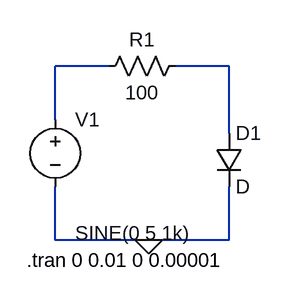
[diagram p0: schematic Rectificador de media vuelta.asc]
Rectificador de media vuelta.asc, the LTspice schematic file:
Version 4
SHEET 1 880 680
WIRE 128 -112 64 -112
WIRE 272 -112 208 -112
WIRE 64 -48 64 -112
WIRE 272 -32 272 -112
WIRE 64 96 64 32
WIRE 176 96 64 96
WIRE 272 96 272 32
WIRE 272 96 176 96
FLAG 176 96 0
SYMBOL diode 256 -32 R0
SYMATTR InstName D1
SYMBOL res 224 -128 R90
WINDOW 0 0 56 VBottom 2
WINDOW 3 32 56 VTop 2
SYMATTR InstName R1
SYMATTR Value 100
SYMBOL voltage 64 -64 R0
WINDOW 3 24 152 Left 2
WINDOW 123 24 124 Left 2
WINDOW 39 0 0 Left 0
SYMATTR InstName V1
SYMATTR Value SINE(0 5 1k)
TEXT 30 120 Left 2 !.tran 0 0.01 0 0.00001

The netlist it stands for:
* Rectificador de media vuelta.asc
D1 N002 0 D
R1 N002 N001 100
V1 N001 0 SINE(0 5 1k)
.model D D
.lib standard.dio
.tran 0 0.01 0 0.00001
.backanno
.end